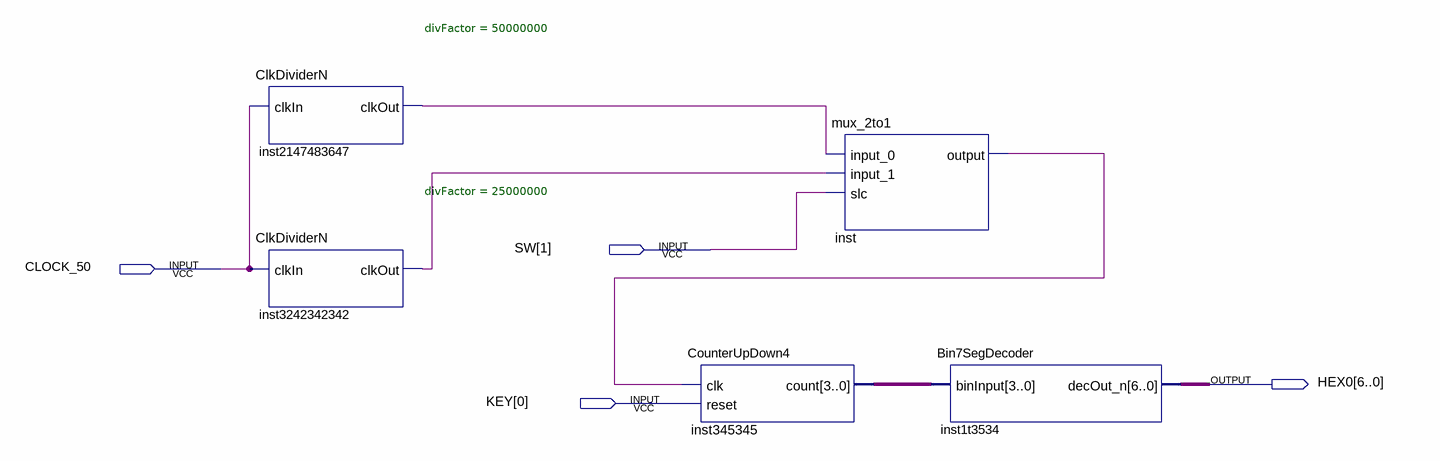
[diagram p0: schematic sheet]
// Quartus schematic Projeto.bdf as structural Verilog: 5 symbols, 4 pins
module Projeto (
  input  [1:1] SW,
  input  CLOCK_50,
  input  [0:0] KEY,
  output [6:0] HEX0
);

  wire inst2147483647_clkout, inst3242342342_clkout, inst_output;
  wire [3:0] inst345345_count;

  ClkDividerN #(.divFactor(50000000)) inst2147483647 (.clkIn(CLOCK_50), .clkOut(inst2147483647_clkout));
  ClkDividerN #(.divFactor(25000000)) inst3242342342 (.clkIn(CLOCK_50), .clkOut(inst3242342342_clkout));
  CounterUpDown4 inst345345 (.clk(inst_output), .reset(KEY[0]), .count(inst345345_count));
  mux_2to1 inst (.input_0(inst2147483647_clkout), .input_1(inst3242342342_clkout), .slc(SW[1]), .\output (inst_output));
  Bin7SegDecoder inst1t3534 (.binInput(inst345345_count), .decOut_n(HEX0));
endmodule
